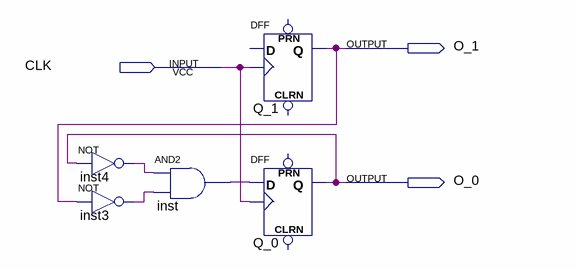
[diagram p0: schematic sheet]
// Quartus schematic hw11p2.bdf as structural Verilog: 5 symbols, 3 pins
module hw11p2 (
  input  CLK,
  output O_1,
  output O_0
);

  wire inst3_out, inst4_out, inst_out;

  not inst4 (inst4_out, O_0);
  not inst3 (inst3_out, O_1);
  and inst (inst_out, inst4_out, inst3_out);
  DFF Q_1 (.CLK(CLK), .Q(O_1));  // open: CLRN, D, PRN
  DFF Q_0 (.CLK(CLK), .D(inst_out), .Q(O_0));  // open: CLRN, PRN
endmodule
